# EasyEDA Pro project ROM外接板.eprj, board PCB1
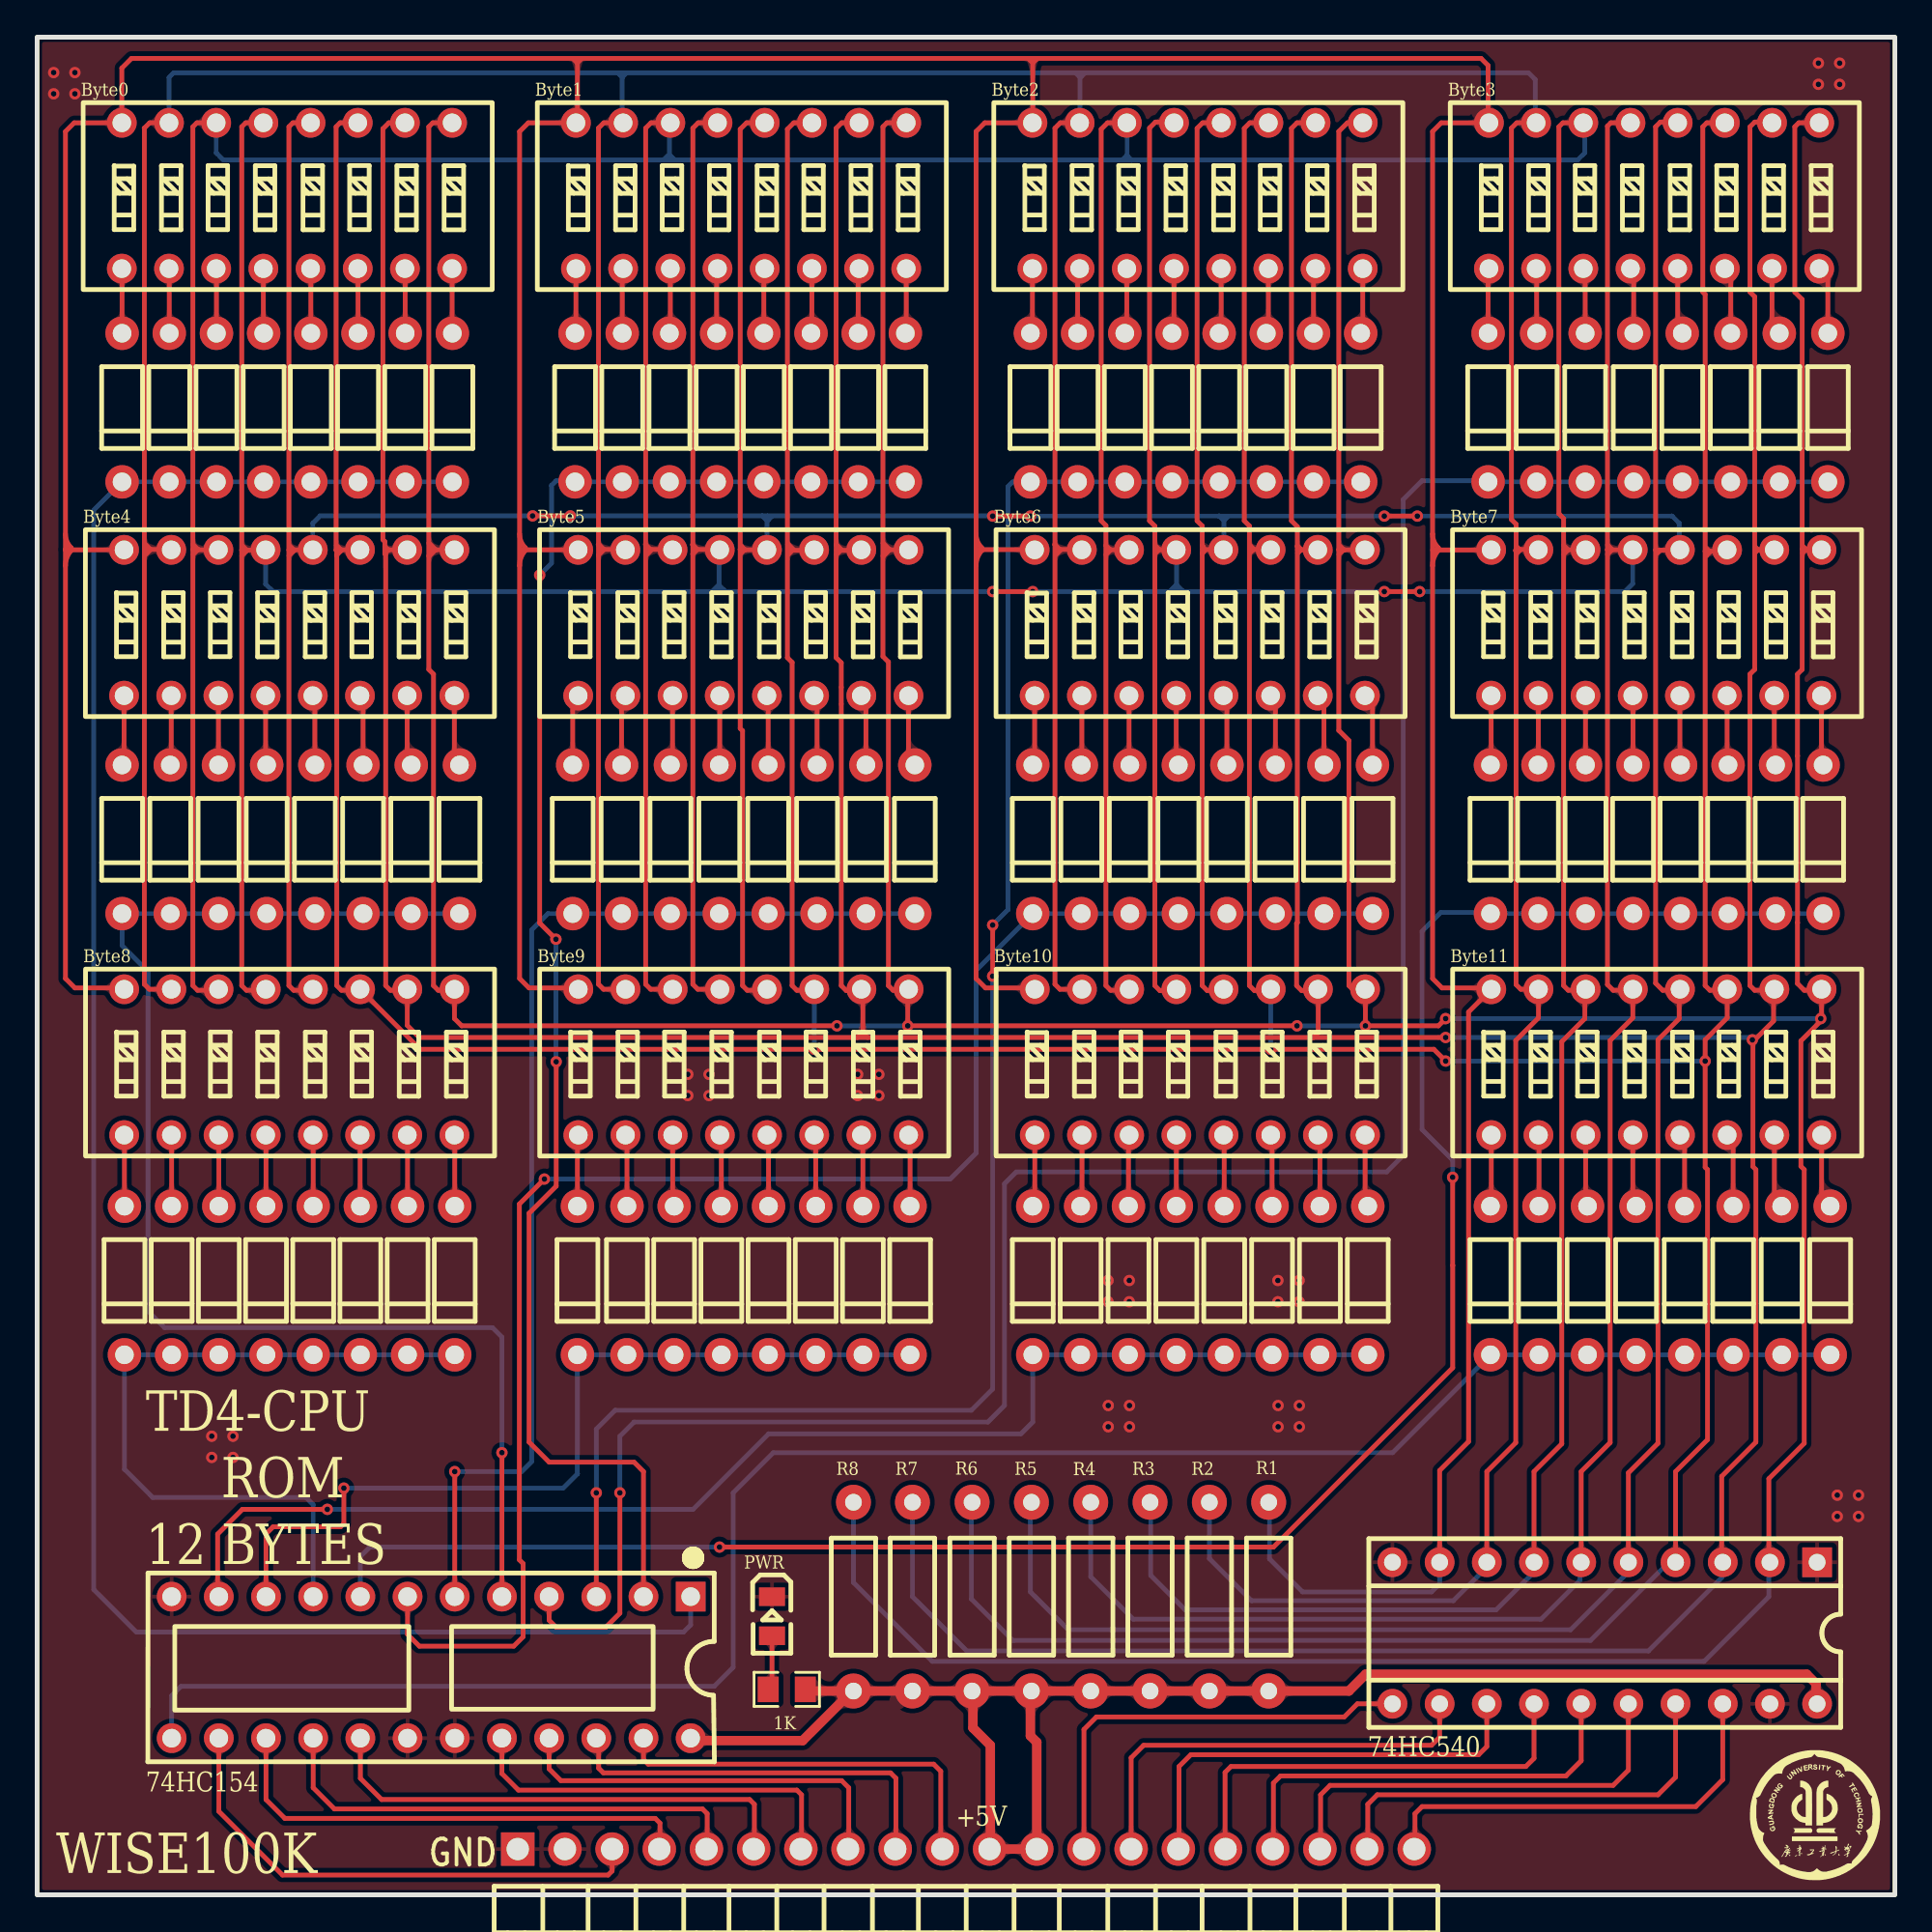
[diagram p1: board, top side]
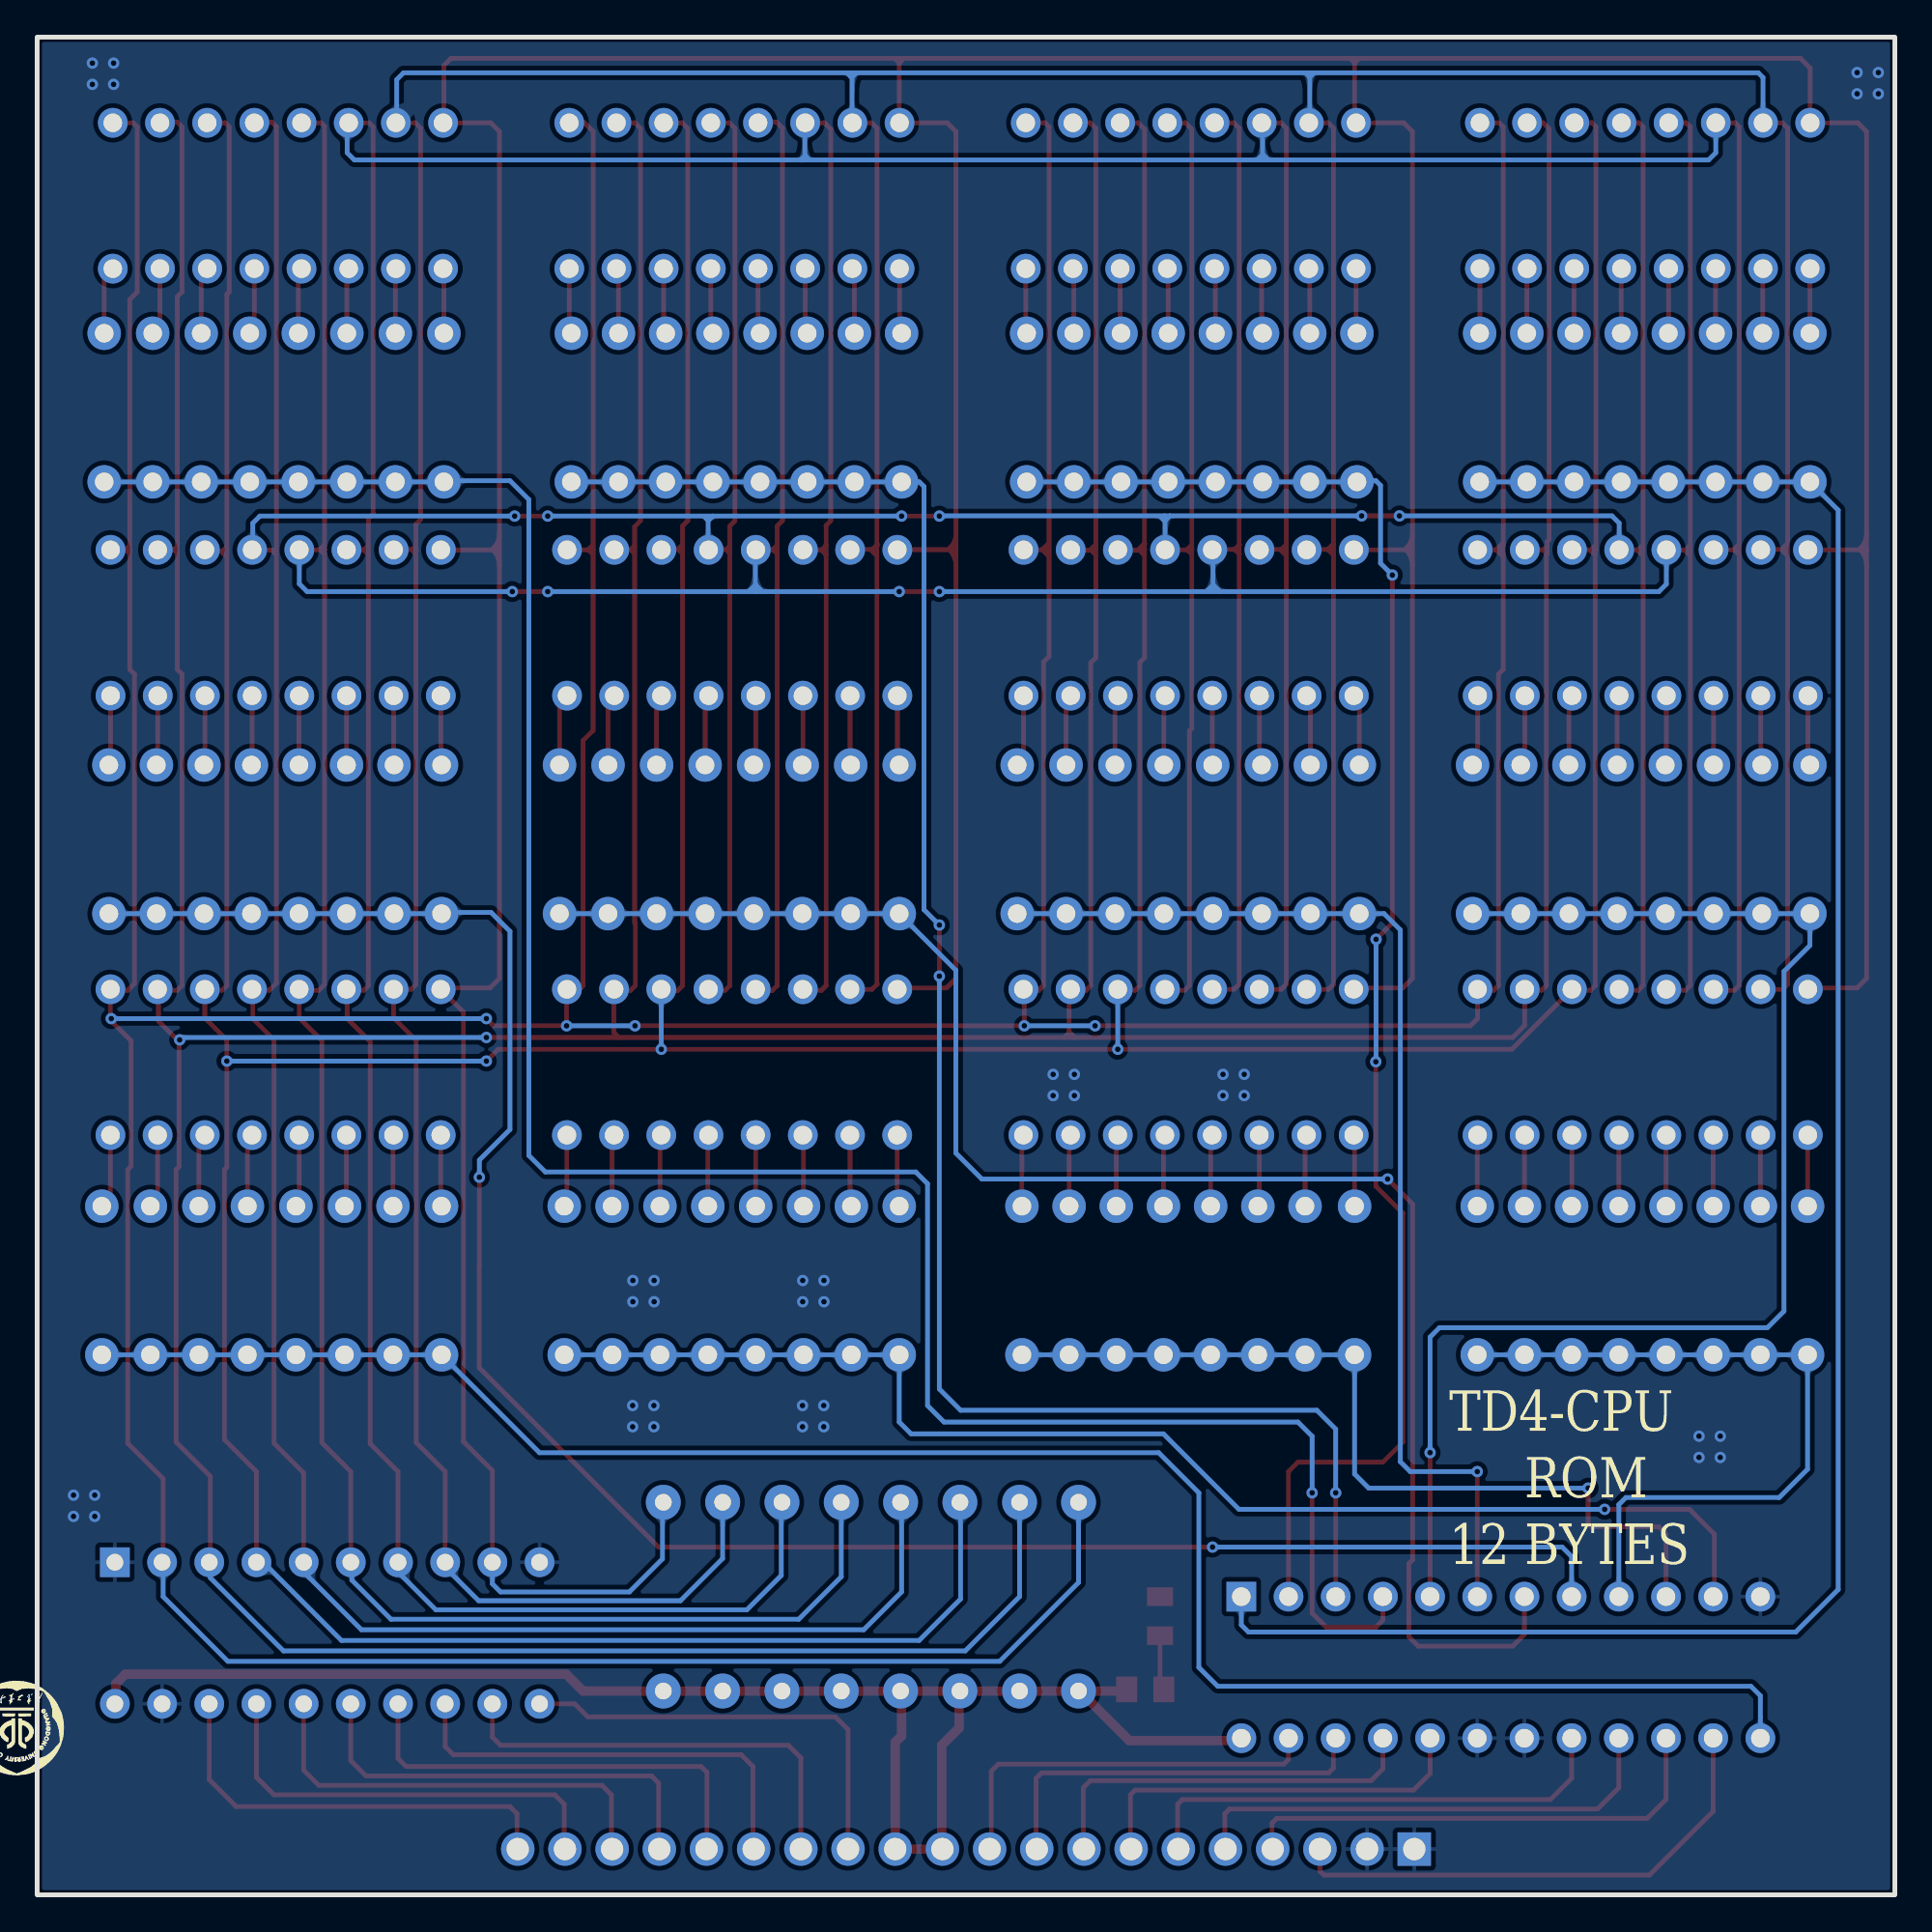
[diagram p2: board, bottom side, seen from below]

Outline 100 x 100 mm; copper layers: Top Layer, Bottom Layer. Coordinates in mm from the lower left corner of the outline.
Outline path: rectangle 0,100 100,0
Stack: Top Layer 0.035mm / Dielectric1 1.51mm FR4 er 4.5 / Bottom Layer 0.035mm

## Design rules (mm)
net +5V: VCC
template: 自定义配置
spacing copperThickness1oz (default): track to track 0.102, other pairs 0.152 to 0.3
spacing copperThickness2oz: track to track 0.203, other pairs 0.152 to 0.3
track width copperThickness1oz (default): min 0.127, default 0.254, max 2.54
track width copperThickness2oz: min 0.203, default 0.254, max 2.54
track width VCC: min 0.127, default 0.508, max 2.54
differential pair differentialPair (default): width min 0.127, default 0.254, max 2.54; gap min 0.152, default 0.152
via viaSize (default): diameter min 0.5, default 0.61, max 10; hole min 0.3, default 0.305, max 6.299
net class VCC uses VCC
net +5V uses VCC

## Placement (name value [footprint] x y rotation side)
1K  10K  [R0805]  40.35 11.06 180 top
Byte0  2.54插件8位拨码开关  [SW-TH_16P-L21.9-W9.9-P2.54-LS7.8]  13.45 91.46 0 top
Byte1  2.54插件8位拨码开关  [SW-TH_16P-L21.9-W9.9-P2.54-LS7.8]  37.89 91.46 0 top
Byte2  2.54插件8位拨码开关  [SW-TH_16P-L21.9-W9.9-P2.54-LS7.8]  62.47 91.46 0 top
Byte3  2.54插件8位拨码开关  [SW-TH_16P-L21.9-W9.9-P2.54-LS7.8]  87.04 91.46 0 top
Byte4  2.54插件8位拨码开关  [SW-TH_16P-L21.9-W9.9-P2.54-LS7.8]  13.57 68.48 0 top
Byte5  2.54插件8位拨码开关  [SW-TH_16P-L21.9-W9.9-P2.54-LS7.8]  38.01 68.48 0 top
Byte6  2.54插件8位拨码开关  [SW-TH_16P-L21.9-W9.9-P2.54-LS7.8]  62.59 68.48 0 top
Byte7  2.54插件8位拨码开关  [SW-TH_16P-L21.9-W9.9-P2.54-LS7.8]  87.16 68.48 0 top
Byte8  2.54插件8位拨码开关  [SW-TH_16P-L21.9-W9.9-P2.54-LS7.8]  13.57 44.82 0 top
Byte9  2.54插件8位拨码开关  [SW-TH_16P-L21.9-W9.9-P2.54-LS7.8]  38.02 44.82 0 top
Byte10  2.54插件8位拨码开关  [SW-TH_16P-L21.9-W9.9-P2.54-LS7.8]  62.59 44.82 0 top
Byte11  2.54插件8位拨码开关  [SW-TH_16P-L21.9-W9.9-P2.54-LS7.8]  87.17 44.82 0 top
D1  1N4148  [DO-35_BD2.0-L4.0-P8.00-D0.5-FD]  4.7 33.07 270 top
D2  1N4148  [DO-35_BD2.0-L4.0-P8.00-D0.5-FD]  7.24 33.07 270 top
D3  1N4148  [DO-35_BD2.0-L4.0-P8.00-D0.5-FD]  9.78 33.07 270 top
D4  1N4148  [DO-35_BD2.0-L4.0-P8.00-D0.5-FD]  12.32 33.07 270 top
D5  1N4148  [DO-35_BD2.0-L4.0-P8.00-D0.5-FD]  14.86 33.07 270 top
D6  1N4148  [DO-35_BD2.0-L4.0-P8.00-D0.5-FD]  17.4 33.07 270 top
D7  1N4148  [DO-35_BD2.0-L4.0-P8.00-D0.5-FD]  19.94 33.07 270 top
D8  1N4148  [DO-35_BD2.0-L4.0-P8.00-D0.5-FD]  22.48 33.07 270 top
D9  1N4148  [DO-35_BD2.0-L4.0-P8.00-D0.5-FD]  29.08 33.07 270 top
D10  1N4148  [DO-35_BD2.0-L4.0-P8.00-D0.5-FD]  31.75 33.07 270 top
D11  1N4148  [DO-35_BD2.0-L4.0-P8.00-D0.5-FD]  34.29 33.07 270 top
D12  1N4148  [DO-35_BD2.0-L4.0-P8.00-D0.5-FD]  36.83 33.07 270 top
D13  1N4148  [DO-35_BD2.0-L4.0-P8.00-D0.5-FD]  39.37 33.07 270 top
D14  1N4148  [DO-35_BD2.0-L4.0-P8.00-D0.5-FD]  41.91 33.07 270 top
D15  1N4148  [DO-35_BD2.0-L4.0-P8.00-D0.5-FD]  44.45 33.07 270 top
D16  1N4148  [DO-35_BD2.0-L4.0-P8.00-D0.5-FD]  46.99 33.07 270 top
D17  1N4148  [DO-35_BD2.0-L4.0-P8.00-D0.5-FD]  53.59 33.07 270 top
D18  1N4148  [DO-35_BD2.0-L4.0-P8.00-D0.5-FD]  56.17 33.07 270 top
D19  1N4148  [DO-35_BD2.0-L4.0-P8.00-D0.5-FD]  58.75 33.07 270 top
D20  1N4148  [DO-35_BD2.0-L4.0-P8.00-D0.5-FD]  61.32 33.07 270 top
D21  1N4148  [DO-35_BD2.0-L4.0-P8.00-D0.5-FD]  63.9 33.07 270 top
D22  1N4148  [DO-35_BD2.0-L4.0-P8.00-D0.5-FD]  66.48 33.07 270 top
D23  1N4148  [DO-35_BD2.0-L4.0-P8.00-D0.5-FD]  69.05 33.07 270 top
D24  1N4148  [DO-35_BD2.0-L4.0-P8.00-D0.5-FD]  71.63 33.07 270 top
D25  1N4148  [DO-35_BD2.0-L4.0-P8.00-D0.5-FD]  78.23 33.07 270 top
D26  1N4148  [DO-35_BD2.0-L4.0-P8.00-D0.5-FD]  80.84 33.07 270 top
D27  1N4148  [DO-35_BD2.0-L4.0-P8.00-D0.5-FD]  83.46 33.07 270 top
D28  1N4148  [DO-35_BD2.0-L4.0-P8.00-D0.5-FD]  86.07 33.07 270 top
D29  1N4148  [DO-35_BD2.0-L4.0-P8.00-D0.5-FD]  88.68 33.07 270 top
D30  1N4148  [DO-35_BD2.0-L4.0-P8.00-D0.5-FD]  91.29 33.07 270 top
D31  1N4148  [DO-35_BD2.0-L4.0-P8.00-D0.5-FD]  93.91 33.07 270 top
D32  1N4148  [DO-35_BD2.0-L4.0-P8.00-D0.5-FD]  96.52 33.07 270 top
D65  1N4148  [DO-35_BD2.0-L4.0-P8.00-D0.5-FD]  4.57 80.06 270 top
D66  1N4148  [DO-35_BD2.0-L4.0-P8.00-D0.5-FD]  7.11 80.06 270 top
D67  1N4148  [DO-35_BD2.0-L4.0-P8.00-D0.5-FD]  9.65 80.06 270 top
D68  1N4148  [DO-35_BD2.0-L4.0-P8.00-D0.5-FD]  12.19 80.06 270 top
D69  1N4148  [DO-35_BD2.0-L4.0-P8.00-D0.5-FD]  14.73 80.06 270 top
D70  1N4148  [DO-35_BD2.0-L4.0-P8.00-D0.5-FD]  17.27 80.06 270 top
D71  1N4148  [DO-35_BD2.0-L4.0-P8.00-D0.5-FD]  19.81 80.06 270 top
D72  1N4148  [DO-35_BD2.0-L4.0-P8.00-D0.5-FD]  22.35 80.06 270 top
D73  1N4148  [DO-35_BD2.0-L4.0-P8.00-D0.5-FD]  28.96 80.06 270 top
D74  1N4148  [DO-35_BD2.0-L4.0-P8.00-D0.5-FD]  31.5 80.06 270 top
D75  1N4148  [DO-35_BD2.0-L4.0-P8.00-D0.5-FD]  34.04 80.06 270 top
D76  1N4148  [DO-35_BD2.0-L4.0-P8.00-D0.5-FD]  36.58 80.06 270 top
D77  1N4148  [DO-35_BD2.0-L4.0-P8.00-D0.5-FD]  39.12 80.06 270 top
D78  1N4148  [DO-35_BD2.0-L4.0-P8.00-D0.5-FD]  41.66 80.06 270 top
D79  1N4148  [DO-35_BD2.0-L4.0-P8.00-D0.5-FD]  44.2 80.06 270 top
D80  1N4148  [DO-35_BD2.0-L4.0-P8.00-D0.5-FD]  46.74 80.06 270 top
D81  1N4148  [DO-35_BD2.0-L4.0-P8.00-D0.5-FD]  53.47 80.06 270 top
D82  1N4148  [DO-35_BD2.0-L4.0-P8.00-D0.5-FD]  56.01 80.06 270 top
D83  1N4148  [DO-35_BD2.0-L4.0-P8.00-D0.5-FD]  58.55 80.06 270 top
D84  1N4148  [DO-35_BD2.0-L4.0-P8.00-D0.5-FD]  61.09 80.06 270 top
D85  1N4148  [DO-35_BD2.0-L4.0-P8.00-D0.5-FD]  63.63 80.06 270 top
D86  1N4148  [DO-35_BD2.0-L4.0-P8.00-D0.5-FD]  66.17 80.06 270 top
D87  1N4148  [DO-35_BD2.0-L4.0-P8.00-D0.5-FD]  68.71 80.06 270 top
D88  1N4148  [DO-35_BD2.0-L4.0-P8.00-D0.5-FD]  71.25 80.06 270 top
D89  1N4148  [DO-35_BD2.0-L4.0-P8.00-D0.5-FD]  78.1 80.06 270 top
D90  1N4148  [DO-35_BD2.0-L4.0-P8.00-D0.5-FD]  80.72 80.06 270 top
D91  1N4148  [DO-35_BD2.0-L4.0-P8.00-D0.5-FD]  83.33 80.06 270 top
D92  1N4148  [DO-35_BD2.0-L4.0-P8.00-D0.5-FD]  85.94 80.06 270 top
D93  1N4148  [DO-35_BD2.0-L4.0-P8.00-D0.5-FD]  88.56 80.06 270 top
D94  1N4148  [DO-35_BD2.0-L4.0-P8.00-D0.5-FD]  91.17 80.06 270 top
D95  1N4148  [DO-35_BD2.0-L4.0-P8.00-D0.5-FD]  93.78 80.06 270 top
D96  1N4148  [DO-35_BD2.0-L4.0-P8.00-D0.5-FD]  96.39 80.06 270 top
D97  1N4148  [DO-35_BD2.0-L4.0-P8.00-D0.5-FD]  4.57 56.82 270 top
D98  1N4148  [DO-35_BD2.0-L4.0-P8.00-D0.5-FD]  7.17 56.82 270 top
D99  1N4148  [DO-35_BD2.0-L4.0-P8.00-D0.5-FD]  9.76 56.82 270 top
D100  1N4148  [DO-35_BD2.0-L4.0-P8.00-D0.5-FD]  12.36 56.82 270 top
D101  1N4148  [DO-35_BD2.0-L4.0-P8.00-D0.5-FD]  14.95 56.82 270 top
D102  1N4148  [DO-35_BD2.0-L4.0-P8.00-D0.5-FD]  17.54 56.82 270 top
D103  1N4148  [DO-35_BD2.0-L4.0-P8.00-D0.5-FD]  20.14 56.82 270 top
D104  1N4148  [DO-35_BD2.0-L4.0-P8.00-D0.5-FD]  22.73 56.82 270 top
D105  1N4148  [DO-35_BD2.0-L4.0-P8.00-D0.5-FD]  28.83 56.82 270 top
D106  1N4148  [DO-35_BD2.0-L4.0-P8.00-D0.5-FD]  31.46 56.82 270 top
D107  1N4148  [DO-35_BD2.0-L4.0-P8.00-D0.5-FD]  34.09 56.82 270 top
D108  1N4148  [DO-35_BD2.0-L4.0-P8.00-D0.5-FD]  36.72 56.82 270 top
D109  1N4148  [DO-35_BD2.0-L4.0-P8.00-D0.5-FD]  39.35 56.82 270 top
D110  1N4148  [DO-35_BD2.0-L4.0-P8.00-D0.5-FD]  41.98 56.82 270 top
D111  1N4148  [DO-35_BD2.0-L4.0-P8.00-D0.5-FD]  44.61 56.82 270 top
D112  1N4148  [DO-35_BD2.0-L4.0-P8.00-D0.5-FD]  47.24 56.82 270 top
D113  1N4148  [DO-35_BD2.0-L4.0-P8.00-D0.5-FD]  53.59 56.82 270 top
D114  1N4148  [DO-35_BD2.0-L4.0-P8.00-D0.5-FD]  56.21 56.82 270 top
D115  1N4148  [DO-35_BD2.0-L4.0-P8.00-D0.5-FD]  58.82 56.82 270 top
D116  1N4148  [DO-35_BD2.0-L4.0-P8.00-D0.5-FD]  61.43 56.82 270 top
D117  1N4148  [DO-35_BD2.0-L4.0-P8.00-D0.5-FD]  64.04 56.82 270 top
D118  1N4148  [DO-35_BD2.0-L4.0-P8.00-D0.5-FD]  66.66 56.82 270 top
D119  1N4148  [DO-35_BD2.0-L4.0-P8.00-D0.5-FD]  69.27 56.82 270 top
D120  1N4148  [DO-35_BD2.0-L4.0-P8.00-D0.5-FD]  71.88 56.82 270 top
D121  1N4148  [DO-35_BD2.0-L4.0-P8.00-D0.5-FD]  78.23 56.82 270 top
D122  1N4148  [DO-35_BD2.0-L4.0-P8.00-D0.5-FD]  80.79 56.82 270 top
D123  1N4148  [DO-35_BD2.0-L4.0-P8.00-D0.5-FD]  83.35 56.82 270 top
D124  1N4148  [DO-35_BD2.0-L4.0-P8.00-D0.5-FD]  85.91 56.82 270 top
D125  1N4148  [DO-35_BD2.0-L4.0-P8.00-D0.5-FD]  88.46 56.82 270 top
D126  1N4148  [DO-35_BD2.0-L4.0-P8.00-D0.5-FD]  91.02 56.82 270 top
D127  1N4148  [DO-35_BD2.0-L4.0-P8.00-D0.5-FD]  93.58 56.82 270 top
D128  1N4148  [DO-35_BD2.0-L4.0-P8.00-D0.5-FD]  96.14 56.82 270 top
H3  KH-A2541WR-20P  [HDR-TH_20P-P2.54-H-M-W10.5]  50 2.46 0 top
PWR  KT-0805Y  [LED0805-R-RD]  39.56 15 270 top
R1  10K  [R_AXIAL-0.4]  66.29 16.05 270 top
R2  10K  [R_AXIAL-0.4]  63.1 16.05 270 top
R3  10K  [R_AXIAL-0.4]  59.91 16.05 270 top
R4  10K  [R_AXIAL-0.4]  56.71 16.05 270 top
R5  10K  [R_AXIAL-0.4]  53.52 16.05 270 top
R6  10K  [R_AXIAL-0.4]  50.33 16.05 270 top
R7  10K  [R_AXIAL-0.4]  47.12 16.05 270 top
R8  10K  [R_AXIAL-0.4]  43.94 16.05 270 top
U2  SN74HC540N  [DIP-20_L25.4-W10.2-P2.54-LS10.2-BL_SOCKET]  84.39 14.09 180 top
U18  -  [DIP-24_L30.5-W10.2-P2.54-LS7.6-BL_IC-24P]  21.21 12.24 180 top

## Footprints (pads in the part's own frame, mm; a bottom-side part is the same pattern mirrored in y, then rotated)
DIP-20_L25.4-W10.2-P2.54-LS10.2-BL_SOCKET
  rect 1.6x1.6 hole 0.9: 1(-11.43,-3.81)
  round 1.6 hole 0.9: 2(-8.89,-3.81) 3(-6.35,-3.81) 4(-3.81,-3.81) 5(-1.27,-3.81) 6(1.27,-3.81) 7(3.81,-3.81) 8(6.35,-3.81) 9(8.89,-3.81) 10(11.43,-3.81) 11(11.43,3.81) 12(8.89,3.81) 13(6.35,3.81) 14(3.81,3.81) 15(1.27,3.81) 16(-1.27,3.81) 17(-3.81,3.81) 18(-6.35,3.81) 19(-8.89,3.81) 20(-11.43,3.81)
DIP-24_L30.5-W10.2-P2.54-LS7.6-BL_IC-24P
  rect 1.6x1.6 hole 1: 1(-13.97,-3.81)
  round 1.6 hole 1: 2(-11.43,-3.81) 3(-8.89,-3.81) 4(-6.35,-3.81) 5(-3.81,-3.81) 6(-1.27,-3.81) 7(1.27,-3.81) 8(3.81,-3.81) 9(6.35,-3.81) 10(8.89,-3.81) 11(11.43,-3.81) 12(13.97,-3.81) 13(13.97,3.81) 14(11.43,3.81) 15(8.89,3.81) 16(6.35,3.81) 17(3.81,3.81) 18(1.27,3.81) 19(-1.27,3.81) 20(-3.81,3.81) 21(-6.35,3.81) 22(-8.89,3.81) 23(-11.43,3.81) 24(-13.97,3.81)
DO-35_BD2.0-L4.0-P8.00-D0.5-FD
  round 1.8 hole 1: 1(-4,0) 2(4,0)
HDR-TH_20P-P2.54-H-M-W10.5
  rect 1.8x1.8 hole 1.2: 1(-24.13,0)
  round 1.8 hole 1.2: 2(-21.59,0) 3(-19.05,0) 4(-16.51,0) 5(-13.97,0) 6(-11.43,0) 7(-8.89,0) 8(-6.35,0) 9(-3.81,0) 10(-1.27,0) 11(1.27,0) 12(3.81,0) 13(6.35,0) 14(8.89,0) 15(11.43,0) 16(13.97,0) 17(16.51,0) 18(19.05,0) 19(21.59,0) 20(24.13,0)
LED0805-R-RD
  rect 1x1.399 smd: 1(1.05,0) 2(-1.05,0)
R0805
  rect 1.133x1.377 smd: 1(-1,0) 2(1,0)
R_AXIAL-0.4
  round 1.879 hole 0.899: 1(-5.08,0) 2(5.08,0)
SW-TH_16P-L21.9-W9.9-P2.54-LS7.8
  round 1.6 hole 1: 1(-8.89,-3.925) 2(-6.35,-3.925) 3(-3.81,-3.925) 4(-1.27,-3.925) 5(1.27,-3.925) 6(3.81,-3.925) 7(6.35,-3.925) 8(8.89,-3.925) 9(8.89,3.925) 10(6.35,3.925) 11(3.81,3.925) 12(1.27,3.925) 13(-1.27,3.925) 14(-3.81,3.925) 15(-6.35,3.925) 16(-8.89,3.925)

## Nets
As in the schematic, except:
+5V: 1K.1 H3.11 H3.12 R1.2 R2.2 R3.2 R4.2 R5.2 R6.2 R7.2 R8.2 U2.20 U18.24
GND: H3.1 H3.2 PWR.2 U2.1 U2.10 U2.19 U18.12 U18.18 U18.19
A0: H3.10 U18.23
A1: H3.9 U18.22
A2: H3.8 U18.21
A3: H3.7 U18.20
Y0: D65.2 D66.2 D67.2 D68.2 D69.2 D70.2 D71.2 D72.2 U18.1
Y1: D73.2 D74.2 D75.2 D76.2 D77.2 D78.2 D79.2 D80.2 U18.2
Y2: D81.2 D82.2 D83.2 D84.2 D85.2 D86.2 D87.2 D88.2 U18.3
Y3: D89.2 D90.2 D91.2 D92.2 D93.2 D94.2 D95.2 D96.2 U18.4
Y4: D97.2 D98.2 D99.2 D100.2 D101.2 D102.2 D103.2 D104.2 U18.5
Y5: D105.2 D106.2 D107.2 D108.2 D109.2 D110.2 D111.2 D112.2 U18.6
Y6: D113.2 D114.2 D115.2 D116.2 D117.2 D118.2 D119.2 D120.2 U18.7
Y7: D121.2 D122.2 D123.2 D124.2 D125.2 D126.2 D127.2 D128.2 U18.8
Y8: D1.2 D2.2 D3.2 D4.2 D5.2 D6.2 D7.2 D8.2 U18.9
Y9: D9.2 D10.2 D11.2 D12.2 D13.2 D14.2 D15.2 D16.2 U18.10
Y10: D17.2 D18.2 D19.2 D20.2 D21.2 D22.2 D23.2 D24.2 U18.11
Y12: H3.3 U18.14
Y13: H3.4 U18.15
Y14: H3.5 U18.16
Y15: H3.6 U18.17
$1N30826: 1K.2 PWR.1

## Via types
v1: diameter 0.61, hole 0.305, Top Layer to Bottom Layer, 76 vias

## Routing (per net, layer and track width the routed paths; a pad name or vN(x,y) marks a point on that pad's centre or on a via; arc(x,y) is an arc through that point)
+5V: length 86
  Top Layer w0.508: 43.88,10.97 41.21,8.3 35.18,8.3 ; 43.88,10.97 41.42,10.97 41.33,11.06 ; 43.88,10.97 R8.2 R6.2 50.46,10.97 ; R5.2 R4.2 R3.2 R2.2 R1.2 ; R5.2 50.46,10.97 ; R5.2 53.47,10.92 53.47,8.56 53.81,8.22 H3.12 H3.11 51.31,2.5 51.31,8.05 50.37,8.99 50.37,10.89 50.46,10.97 ; 66.42,10.85 66.55,10.97 70.61,10.97 71.52,11.88 95.25,11.88 95.76,11.37 95.76,10.34 U2.20
GND:
  vias: v1(0.89,98.1) v1(0.89,96.95) v1(2.03,98.1) v1(2.03,96.95) v1(9.4,24.69) v1(9.4,23.55) v1(10.54,24.69) v1(10.54,23.55) v1(35.02,44.17) v1(35.02,43.02) v1(36.17,44.17) v1(36.17,43.02) v1(44.17,44.17) v1(44.17,43.02) v1(45.31,44.17) v1(45.31,43.02) v1(57.65,33.07) v1(57.65,31.93) v1(57.66,26.34) v1(57.66,25.2) v1(58.79,33.07) v1(58.79,31.93) v1(58.8,26.34) v1(58.8,25.2) v1(66.79,33.07) v1(66.79,31.93) v1(66.8,26.34) v1(66.8,25.2) v1(67.93,33.07) v1(67.93,31.93) v1(67.94,26.34) v1(67.94,25.2) v1(95.88,98.6) v1(95.88,97.46) v1(96.9,21.51) v1(96.9,20.37) v1(97.03,98.6) v1(97.03,97.46) v1(98.04,21.51) v1(98.04,20.37)
A0: length 21.5
  Top Layer w0.254: H3.10 48.64,2.55 48.64,6.66 48.26,7.04 32.89,7.04 32.64,7.29 32.64,8.3
A1: length 21.6
  Top Layer w0.254: 30.1,8.3 30.23,8.18 30.23,6.82 30.48,6.57 45.94,6.57 46.23,6.27 46.23,2.5 H3.9
A2: length 21.4
  Top Layer w0.254: 27.56,8.3 27.56,6.78 28.19,6.15 43.31,6.15 43.69,5.77 43.69,2.5 H3.8
A3: length 21.3
  Top Layer w0.254: 25.02,8.3 25.02,6.53 25.91,5.64 40.89,5.64 41.15,5.39 41.15,2.5 H3.7
D0: length 23.3
  Top Layer w0.254: H3.20 74.17,2.5 74.17,4.37 74.55,4.75 89.28,4.75 90.74,6.21 U2.18
D1: length 23.6
  Top Layer w0.254: H3.19 71.63,2.5 71.63,4.88 72.14,5.39 87.25,5.39 88.2,6.33 U2.17
D2: length 23.6
  Top Layer w0.254: H3.18 69.09,2.5 69.09,5.39 69.6,5.89 84.84,5.89 85.66,6.71 U2.16
D3: length 23.7
  Top Layer w0.254: H3.17 66.55,2.5 66.55,6.02 66.93,6.4 82.3,6.4 83.12,7.22 U2.15
D4: length 24
  Top Layer w0.254: H3.16 63.94,2.49 63.94,6.59 64.26,6.91 80.14,6.91 80.58,7.35 U2.14
D5: length 23.8
  Top Layer w0.254: H3.15 61.47,2.5 61.47,6.91 62.1,7.54 77.6,7.54 78.04,7.98 U2.13
D6: length 23.8
  Top Layer w0.254: U2.12 75.5,8.49 75.06,8.05 59.56,8.05 58.89,7.38 H3.14
D7: length 23.6
  Top Layer w0.254: U2.11 71.07,10.28 70.36,9.58 57.02,9.58 56.35,8.9 H3.13
Y0: length 112.8
  Bottom Layer w0.254: U18.1 35.18,14.53 34.8,14.15 5.33,14.15 3.05,16.43 3.05,74.54 D65.2 D66.2 D67.2 D68.2 D69.2 D70.2 D71.2 D72.2
Y1: length 85.5
  Top Layer w0.254: v1(27.05,71.04) 27.05,52.32 v1(27.93,51.44) ; U18.2 32.64,22.78 32.13,23.29 27.56,23.29 26.48,24.37 26.48,36.69 27.94,38.15 v1(27.94,44.85)
  Bottom Layer w0.254: v1(27.93,51.44) 27.93,44.86 v1(27.94,44.85) ; D80.2 D79.2 D78.2 D77.2 D76.2 D75.2 D74.2 D73.2 28.89,76.12 27.94,76.12 27.69,75.87 27.69,71.68 v1(27.05,71.04)
Y2: length 99.3
  Top Layer w0.254: v1(51.44,49.45) v1(51.44,52.2) ; v1(30.1,21.64) U18.3
  Bottom Layer w0.254: v1(51.44,52.2) 52.26,53.03 52.26,75.81 52.51,76.06 D81.2 D82.2 D83.2 D84.2 D85.2 D86.2 D87.2 D88.2 ; v1(51.44,49.45) 51.44,27.23 50.29,26.09 31.12,26.09 30.1,25.07 v1(30.1,21.64)
Y3: length 129.1
  Top Layer w0.254: v1(31.37,21.64) 31.37,15.16 30.61,14.4 27.94,14.4 27.56,14.78 U18.4
  Bottom Layer w0.254: D96.2 D95.2 D94.2 D93.2 D92.2 D91.2 D90.2 D89.2 78.04,76.12 74.55,76.12 73.53,75.11 73.53,39.8 72.64,38.91 52.71,38.91 52.07,38.28 52.07,26.34 51.18,25.45 32.13,25.45 31.37,24.69 v1(31.37,21.64)
Y4: length 73.7
  Top Layer w0.254: v1(25.02,23.8) U18.5
  Bottom Layer w0.254: v1(25.02,23.8) 25.02,30.02 24.51,30.53 6.86,30.53 5.97,31.42 5.97,49.71 4.57,51.11 D97.2 D98.2 D99.2 D100.2 D101.2 D102.2 D103.2 D104.2
Y5: length 60.7
  Top Layer w0.254: v1(22.48,22.78) U18.6
  Bottom Layer w0.254: D112.2 D111.2 D110.2 D109.2 D108.2 D107.2 D106.2 D105.2 27.5,52.82 26.62,51.94 26.62,23.32 26.09,22.78 v1(22.48,22.78)
Y6: length 90.3
  Top Layer w0.254: v1(27.31,38.53) 25.96,37.19 25.96,18.03 26.16,17.83 26.16,13.89 25.65,13.39 20.57,13.39 19.94,14.02 U18.7 19.89,16.1
  Bottom Layer w0.254: v1(27.31,38.53) 49.15,38.53 50.55,39.93 50.55,49.77 D113.2 D114.2 D115.2 D116.2 D117.2 D118.2 D119.2 D120.2
Y7: length 111.4
  Top Layer w0.254: v1(36.73,18.72) 66.55,18.72 76.2,28.37 76.2,33.88 76.2,33.88 v1(76.2,38.63)
  Bottom Layer w0.254: v1(36.73,18.72) 17.91,18.72 17.4,18.21 U18.8 ; v1(76.2,38.63) 76.2,39.55 74.55,41.2 74.55,51.87 75.56,52.88 78.17,52.88 D121.2 D122.2 D123.2 D124.2 D125.2 D126.2 D127.2 D128.2
Y8: length 39.8
  Bottom Layer w0.254: U18.9 14.86,21.01 14.48,21.39 6.22,21.39 4.7,22.91 D1.2 D2.2 D3.2 D4.2 D5.2 D6.2 D7.2 D8.2
Y9: length 46.9
  Top Layer w0.254: v1(16.51,21.9) 16.51,19.99 16.33,19.81 12.7,19.81 12.32,19.43 U18.10
  Bottom Layer w0.254: D16.2 D15.2 D14.2 D13.2 D12.2 D11.2 D10.2 D9.2 29.08,22.66 28.32,21.9 v1(16.51,21.9)
Y10: length 71.4
  Top Layer w0.254: v1(15.62,20.75) 11.05,20.75 9.72,19.42 9.72,16.12 U18.11
  Bottom Layer w0.254: D24.2 D23.2 D22.2 D21.2 D20.2 D19.2 D18.2 D17.2 53.59,25.45 52.96,24.82 39.37,24.82 35.31,20.75 v1(15.62,20.75)
Y11: length 104.8
  Bottom Layer w0.254: 7.24,8.3 7.24,10.72 7.75,11.23 36.45,11.23 37.47,12.24 37.47,21.64 39.62,23.8 72.96,23.8 D25.2 D26.2 D27.2 D28.2 D29.2 D30.2 D31.2 D32.2
Y12: length 27.7
  Top Layer w0.254: 9.78,8.3 9.78,4.5 13.21,1.07 30.73,1.07 30.95,1.28 H3.3
Y13: length 26.3
  Top Layer w0.254: 12.32,8.3 12.32,5.13 13.33,4.12 33.27,4.12 33.53,3.86 33.53,2.5 H3.4
Y14: length 26.2
  Top Layer w0.254: H3.5 36.07,2.5 36.07,4.37 35.81,4.62 16,4.62 14.86,5.77 14.86,8.3
Y15: length 26.2
  Top Layer w0.254: H3.6 38.61,2.5 38.61,4.88 38.35,5.13 18.54,5.13 17.4,6.27 17.4,8.3
$1N2008: length 375.1
  Top Layer w0.254: Byte2.9 70.53,95.39 70.07,94.93 70.07,72.41 ; 46.86,48.7 Byte9.9 ; 46.86,48.7 v1(46.86,46.78) v1(67.82,46.78) ; 46.86,48.7 46.85,48.69 46.08,48.69 45.82,48.95 45.82,66.37 45.53,66.66 45.53,95.17 45.74,95.39 Byte1.9 ; 21.16,72.41 21.16,72.41 21.4,72.41 ; 70.35,72.4 70.32,72.4 70.08,72.16 ; 70.35,72.4 70.34,72.4 ; 70.35,72.4 70.38,72.4 ; 70.35,72.4 70.35,72.4 ; 45.85,72.41 45.61,72.41 45.6,72.41 ; 21.45,72.39 21.43,72.39 ; 21.43,72.39 21.43,72.43 21.09,72.77 21.09,72.77 ; 21.43,72.39 21.12,72.08 21.08,72.08 ; 21.46,72.4 21.45,72.39 21.45,72.4 21.46,72.4 ; 21.46,72.4 21.47,72.41 ; 21.46,72.4 22.46,72.4 ; 95.22,72.44 95.05,72.6 ; 95.22,72.44 95.23,72.42 ; 95.22,72.44 96.02,72.44 96.05,72.4 95.25,72.4 95.23,72.42 ; 95.22,72.44 95.01,72.44 ; 45.53,72.08 45.56,72.08 45.88,72.39 45.88,72.43 45.54,72.77 45.54,72.77 ; 70.34,72.4 70.1,72.65 ; 70.34,72.4 70.07,72.4 70.07,72.41 ; 70.34,72.4 70.38,72.4 ; 71.48,72.4 70.38,72.4 ; 95.23,72.42 95.02,72.22 ; 95.23,72.42 95.23,72.43 ; Byte0.9 21.3,95.39 21.08,95.17 21.08,65.96 21.34,65.71 21.34,48.95 21.59,48.69 22.41,48.69 Byte8.9 22.46,47.17 22.85,46.78 v1(43.05,46.78) ; 95.01,72.44 95.01,85.88 94.62,86.28 94.62,95.17 94.83,95.39 Byte3.9 ; 95.01,72.44 95.01,65.96 94.76,65.71 94.76,61.31 94.76,61.31 94.76,52.33 94.76,52.33 94.76,49.06 95.12,48.69 96,48.69 Byte11.9 96.06,47.09 94.94,45.97 94.94,39.22 95.12,39.04 95.12,24.31 93.22,22.4 93.22,17.96 93.28,17.9 ; 46.9,72.4 45.91,72.4 ; 70.07,72.41 70.07,62.68 70.61,62.14 70.61,48.95 70.81,48.75 Byte10.9 71.5,48.73 v1(71.5,46.78) 75.43,46.78 v1(75.82,47.17)
  Bottom Layer w0.254: v1(43.05,46.78) v1(46.86,46.78) ; 93.28,17.9 93.22,17.85 93.22,16.05 89.74,12.57 48.19,12.57 43.94,16.81 R8.1 ; v1(67.82,46.78) v1(71.5,46.78) ; v1(75.82,47.17) v1(96.01,47.17)
$1N2018: length 367.7
  Top Layer w0.254: 93.47,48.7 93.47,47.04 92.36,45.93 92.36,39.2 92.52,39.04 92.52,24.37 90.68,22.53 90.68,17.96 90.74,17.9 ; 93.47,48.7 Byte11.10 ; 93.47,48.7 93.46,48.69 92.46,48.69 92.2,48.95 92.2,65.71 92.46,65.96 92.46,72.35 ; Byte2.10 67.82,95.39 67.52,95.09 67.52,73.97 67.84,73.65 67.84,72.59 ; 92.46,72.35 92.46,86.03 92.2,86.28 92.2,95.17 92.46,95.43 93.35,95.43 Byte3.10 ; 92.46,72.35 92.51,72.4 92.63,72.4 ; 18.72,72.2 18.72,72.58 ; 18.72,72.2 18.76,72.15 18.76,48.95 19.02,48.69 19.87,48.69 Byte8.10 19.92,46.8 20.57,46.15 44.15,46.15 ; 18.72,72.2 18.91,72.39 ; 18.72,72.58 18.91,72.39 ; 18.72,72.58 18.72,72.84 18.61,72.95 18.61,95.07 18.93,95.39 Byte0.10 ; 68.94,72.4 68.04,72.4 ; 68.04,72.4 67.85,72.4 67.85,72.41 ; 68.04,72.4 68.05,72.41 ; 68.04,72.4 67.86,72.23 67.84,72.23 ; 92.63,72.4 92.64,72.41 ; 92.63,72.4 93.51,72.4 ; 92.63,72.4 92.47,72.24 ; 43.01,72.67 43.01,66.6 43.28,66.32 43.28,65 43.28,48.95 43.55,48.68 44.3,48.68 Byte9.10 44.45,48.67 44.45,46.45 44.15,46.15 ; 43.01,72.67 43.01,95.09 43.31,95.39 Byte1.10 ; 43.01,72.67 43.04,72.67 43.32,72.39 ; 44.15,46.15 68.7,46.15 ; 68.7,46.15 68.96,46.41 68.96,48.73 Byte10.10 68.38,48.75 68.31,48.68 68.06,48.68 67.8,48.95 67.8,52.29 67.84,52.33 67.84,72.59 ; 68.7,46.15 v1(75.82,46.15) ; 68.05,72.41 68.05,72.41 ; 68.05,72.41 68.05,72.42 ; 68.05,72.41 67.86,72.59 67.84,72.59 ; 44.36,72.38 43.26,72.38 ; 43.26,72.38 43.02,72.14 ; 43.26,72.38 43.02,72.38 ; 43.26,72.38 43.28,72.4 ; 44.43,46.41 44.45,46.41 44.71,46.15 ; 18.91,72.39 18.92,72.4 19.92,72.4 ; 18.91,72.39 18.93,72.41 ; 67.84,72.59 67.83,72.59 ; 92.64,72.41 92.47,72.57
  Bottom Layer w0.254: R7.1 47.12,16.05 50.04,13.13 86.74,13.13 90.68,17.07 90.68,17.85 90.74,17.9 ; v1(92.33,46.03) 92.2,46.15 v1(75.82,46.15)
$1N2040: length 362.5
  Top Layer w0.254: 41.82,72.38 40.66,72.38 ; 40.66,72.38 40.44,72.38 40.4,72.42 ; 40.66,72.38 40.67,72.39 ; 40.66,72.38 40.4,72.12 ; 90.04,72.3 90.02,72.33 ; 90.02,72.33 90.89,72.33 90.97,72.4 ; 90.02,72.33 89.84,72.51 ; 90.02,72.33 89.79,72.33 ; 66.4,72.42 65.48,72.42 ; 65.48,72.42 65.31,72.42 ; 65.48,72.42 65.49,72.44 ; 65.48,72.42 65.27,72.21 ; 89.79,72.33 89.79,48.95 90.04,48.69 90.92,48.69 Byte11.11 90.98,47.21 89.79,46.03 v1(89.79,44.88) 89.79,39.17 89.92,39.04 89.92,24.5 88.2,22.78 88.2,17.9 ; 89.79,72.33 89.79,86.16 89.66,86.28 89.66,95.17 89.88,95.39 Byte3.11 ; 65.48,72.45 65.29,72.64 65.27,72.64 ; 16.13,72.12 16.12,72.11 ; 16.13,72.12 16.36,72.35 16.36,72.39 16.09,72.39 ; 16.13,72.12 16.13,72.36 16.09,72.39 ; 16.12,72.11 16.13,72.1 16.13,48.95 16.38,48.69 17.33,48.69 Byte8.11 20.61,45.52 v1(41.83,45.52) v1(66.4,45.52) 75.18,45.52 v1(75.82,44.88) ; 16.12,72.11 16.12,72.1 ; Byte1.11 40.73,95.39 40.39,95.05 40.39,66.6 40.64,66.35 40.64,48.95 40.89,48.69 41.78,48.69 Byte9.11 ; 16.09,72.39 16.09,95.17 16.31,95.39 Byte0.11 ; Byte2.11 65.28,95.39 64.98,95.09 64.98,73.97 65.26,73.69 65.26,48.95 65.52,48.68 66.34,48.68 Byte10.11 ; 17.38,72.4 16.38,72.4 16.37,72.39 16.11,72.65 ; 90.08,72.31 89.86,72.09 89.81,72.09 ; 40.75,72.39 40.43,72.71 40.39,72.71
  Bottom Layer w0.254: R6.1 50.29,21.1 50.29,15.93 52.53,13.69 83.62,13.69 88.2,18.27 88.2,17.9 ; v1(75.82,44.88) v1(89.79,44.88) ; Byte10.11 v1(66.4,45.52) ; Byte9.11 v1(41.83,45.52)
$1N2047: length 356.4
  Top Layer w0.254: Byte3.12 88.27,95.43 87.38,95.43 87.12,95.17 87.12,72.39 ; 38.08,72.4 38.09,72.41 38.1,72.41 ; 38.08,72.4 37.87,72.4 37.85,72.42 ; 38.08,72.4 37.85,72.18 ; 38.08,72.4 38.11,72.4 ; 62.72,72.21 62.72,73.69 62.44,73.97 62.44,95.09 62.74,95.39 Byte2.12 ; 62.72,72.21 62.72,48.95 62.98,48.68 63.24,48.68 63.3,48.75 Byte10.12 ; 62.72,72.21 62.79,72.29 arc(62.83,72.34) 62.84,72.4 ; 62.72,72.21 62.71,72.21 ; 87.12,72.39 87.38,72.39 87.16,72.17 ; 87.12,72.39 87.12,49.07 87.5,48.69 88.38,48.69 88.39,48.7 ; 39.28,72.4 38.11,72.4 ; 38.11,72.4 38.1,72.41 ; Byte0.12 13.77,95.39 13.55,95.17 13.55,72.39 ; 37.85,72.42 37.85,95.05 38.19,95.39 Byte1.12 ; 37.85,72.42 37.85,62.79 37.97,62.66 37.97,48.95 38.23,48.69 39.24,48.69 Byte9.12 ; 88.39,48.7 88.39,47.17 87.25,46.03 87.25,24.31 85.66,22.72 85.66,17.9 ; 88.39,48.7 Byte11.12 ; Byte8.12 14.79,48.69 13.81,48.69 13.55,48.95 13.55,72.39 ; 13.55,72.39 13.82,72.39 13.82,72.35 13.56,72.09 ; 87.43,72.39 88.42,72.39 88.43,72.4 ; 38.11,72.41 38.1,72.41 ; 38.1,72.41 37.9,72.61 37.85,72.61 ; v1(26.67,74.23) v1(28.7,74.23) ; 62.72,72.63 62.76,72.58 arc(62.8,72.52) 62.82,72.45 ; v1(72.52,74.22) v1(74.29,74.22) ; 62.75,72.42 62.75,72.42 63.86,72.42 ; 13.57,72.65 13.83,72.39 13.84,72.4 14.84,72.4 ; v1(51.44,74.22) v1(53.47,74.22)
  Bottom Layer w0.254: 39.03,74.23 39.31,74.23 ; 39.03,74.23 v1(28.7,74.23) ; 39.03,74.23 39.02,74.24 ; 39.03,74.23 39.28,73.98 ; 39.31,74.23 51.42,74.23 v1(51.44,74.22) ; 39.31,74.23 39.28,74.2 39.28,73.98 ; 39.28,73.98 39.28,72.4 ; 39.28,73.98 39.3,73.96 ; 64.09,74.19 63.92,74.02 63.86,74.02 ; v1(26.67,74.23) 15.23,74.23 14.84,73.84 14.84,72.4 ; 63.86,72.4 63.88,72.43 63.88,73.97 63.63,74.22 ; R5.1 53.47,21.08 53.47,16.31 55.5,14.27 82.54,14.27 85.66,17.38 85.66,17.9 ; v1(74.29,74.22) 88.01,74.22 88.39,73.84 88.39,72.44 88.43,72.4 ; 39.56,74.22 39.35,74 39.29,74 ; v1(53.47,74.22) 63.63,74.22 ; 63.63,74.22 v1(72.52,74.22)
$1N2054: length 353.1
  Top Layer w0.254: Byte0.13 11.23,95.39 11.01,95.17 11.01,72.39 ; Byte8.13 12.25,48.69 11.27,48.69 11.01,48.95 11.01,72.39 ; 60.41,72.43 60.4,72.42 ; 60.4,72.42 60.2,72.62 ; 60.4,72.42 60.38,72.4 ; 60.4,72.42 60.42,72.41 ; 11.29,72.39 11.03,72.65 ; 11.29,72.39 11.28,72.39 ; 11.29,72.39 11.29,72.39 ; 11.29,72.39 12.29,72.39 12.3,72.4 ; Byte2.13 61.16,95.43 60.2,95.43 59.88,95.11 59.88,73.97 60.17,73.68 60.17,48.95 60.44,48.68 60.69,48.68 60.76,48.75 Byte10.13 ; 11.01,72.39 11.28,72.39 ; 35.3,72.67 35.28,72.69 ; 35.3,72.67 35.54,72.43 ; 35.3,72.67 35.3,72.18 ; 35.3,72.67 35.3,95.1 35.58,95.39 Byte1.13 ; v1(72.52,70.16) v1(74.42,70.16) ; 60.38,72.4 60.18,72.2 ; 60.38,72.4 60.22,72.4 60.21,72.42 ; 60.38,72.4 61.31,72.4 ; 11.28,72.39 11.28,72.39 ; 11.28,72.39 11.28,72.35 11.02,72.09 ; 84.53,72.41 84.53,95.21 84.71,95.39 Byte3.13 ; 84.53,72.41 84.54,72.4 84.77,72.4 ; 84.53,72.41 84.53,49 84.84,48.69 85.84,48.69 Byte11.13 85.9,47.21 84.67,45.99 84.67,24.34 83.12,22.78 83.12,17.9 ; 35.3,72.18 35.54,72.43 ; 35.3,72.18 35.3,49.02 35.57,48.75 Byte9.13 ; 35.54,72.43 36.72,72.43 36.74,72.4 ; 84.8,72.41 84.55,72.66 84.54,72.66 ; 84.77,72.4 84.78,72.4 ; 84.77,72.4 84.54,72.16 ; 84.77,72.4 85.89,72.4 ; v1(51.44,70.16) v1(53.59,70.16)
  Bottom Layer w0.254: 61.33,70.53 61.62,70.23 61.62,70.16 ; 61.33,70.53 61.32,70.54 ; 61.33,70.53 61.34,70.54 61.34,72.38 61.32,72.4 ; 61.33,70.53 61.31,70.51 ; 61.34,70.16 v1(72.52,70.16) ; 61.34,70.16 61.31,70.19 61.31,70.51 ; 61.34,70.16 60.96,70.16 ; 61.34,70.16 61.35,70.14 ; R4.1 56.71,17.12 59,14.84 80.95,14.84 83.06,16.94 83.06,17.85 83.12,17.9 ; v1(53.59,70.16) 60.96,70.16 ; 60.96,70.16 61.31,70.51 ; 36.7,70.48 36.7,70.2 36.69,70.2 ; 61.31,70.51 61.31,70.51 ; 36.32,70.16 12.7,70.16 12.3,70.56 12.3,72.4 ; 36.32,70.16 36.7,70.54 36.7,72.36 36.74,72.4 ; 36.32,70.16 v1(51.44,70.16) ; 36.71,70.5 36.99,70.23 36.99,70.18 ; 85.89,72.4 85.89,70.57 85.47,70.16 v1(74.42,70.16)
$1N2067: length 345.2
  Top Layer w0.254: 32.76,72.68 33.01,72.43 34.18,72.43 34.2,72.4 ; 32.76,72.68 32.74,72.7 ; 32.76,72.68 32.76,49.02 33.03,48.75 Byte9.14 ; 32.76,72.68 32.76,95.1 33.04,95.39 Byte1.14 ; 8.68,72.44 8.67,72.42 ; 8.67,72.42 8.67,72.42 ; 8.67,72.42 8.39,72.7 ; 8.67,72.42 8.65,72.4 ; Byte3.14 82.13,95.39 81.91,95.17 81.91,74.35 82.17,74.09 82.17,48.95 82.42,48.69 83.3,48.69 83.31,48.7 ; 82.41,72.41 82.18,72.64 ; 57.76,72.4 57.76,72.38 57.53,72.14 ; 57.76,72.4 57.76,72.41 ; 57.76,72.4 57.56,72.4 57.55,72.4 ; 57.76,72.4 58.77,72.4 ; 57.76,72.41 57.53,72.64 ; 57.76,72.41 57.76,72.42 ; 57.76,72.41 57.77,72.4 ; 57.53,72.64 57.53,73.71 57.28,73.97 57.28,95.05 57.62,95.39 Byte2.14 ; 57.53,72.64 57.53,48.95 57.78,48.69 58.73,48.69 Byte10.14 ; 8.38,72.41 8.38,48.95 8.64,48.69 9.71,48.69 Byte8.14 ; 8.38,72.41 8.39,72.4 8.65,72.4 ; 8.38,72.41 8.38,95.17 8.6,95.39 Byte0.14 ; 83.31,48.7 83.31,47.17 82.07,45.93 82.07,24.28 80.58,22.78 80.58,17.9 ; 83.31,48.7 Byte11.14 ; 83.35,72.4 82.19,72.4 82.19,72.4 ; 8.65,72.4 8.4,72.16 ; 8.65,72.4 9.76,72.4 ; 82.42,72.4 82.18,72.16 ; 32.78,72.11 33.09,72.41
  Bottom Layer w0.254: Byte2.14 58.67,95.37 58.67,93.65 58.66,93.64 ; 58.41,93.39 58.91,93.39 ; 58.41,93.39 58.66,93.64 ; 58.41,93.39 33.72,93.39 ; 58.91,93.39 58.66,93.64 ; 58.91,93.39 58.91,93.38 ; 58.91,93.39 82.92,93.39 83.31,93.78 83.31,95.31 Byte3.14 ; 58.66,93.64 58.66,93.64 ; 34.03,93.68 34.31,93.4 ; Byte1.14 34.04,95.34 34.04,93.7 33.72,93.39 ; Byte0.14 9.64,93.78 10.03,93.39 33.72,93.39 ; R3.1 59.94,21.1 59.94,17.2 61.8,15.34 78.54,15.34 80.58,17.38 80.58,17.9
$1N2076: length 341.2
  Top Layer w0.254: 80.81,72.4 80.79,72.43 79.8,72.43 ; Byte3.15 79.65,95.39 79.36,95.1 79.36,74.03 79.61,73.78 79.61,72.44 79.63,72.43 79.8,72.43 ; 6.1,72.43 5.8,72.73 ; 6.1,72.43 5.77,72.43 ; 6.1,72.43 7.19,72.43 7.22,72.4 ; 30.22,72.68 30.22,95.1 30.5,95.39 Byte1.15 ; 30.22,72.68 30.2,72.69 ; 30.22,72.68 30.25,72.68 30.51,72.43 31.64,72.43 31.66,72.4 ; 30.22,72.68 30.22,72.12 ; Byte9.15 30.49,48.75 30.22,49.02 30.22,72.12 ; 56.24,72.4 56.21,72.43 55.04,72.43 54.79,72.68 ; 5.77,95.1 5.76,95.1 ; 5.77,95.1 6.06,95.39 Byte0.15 ; 5.77,95.1 5.77,72.43 ; 79.8,72.41 79.8,72.36 79.61,72.18 ; 79.8,72.43 79.62,72.6 ; 79.8,72.43 79.8,72.42 ; 5.77,72.43 5.77,49.02 6.04,48.75 Byte8.15 ; 30.21,72.11 30.22,72.12 ; 30.22,72.12 30.52,72.42 ; 6.1,72.41 6.1,72.4 5.79,72.1 ; 54.79,72.68 54.79,95.1 55.08,95.39 Byte2.15 ; 54.79,72.68 54.79,49.02 55.06,48.75 Byte10.15 ; 54.79,72.68 54.78,72.69 ; 78.04,17.9 78.04,22.78 79.59,24.34 79.59,45.99 80.82,47.21 Byte11.15 79.86,48.75 79.61,49 79.61,72.41 79.57,72.37 ; 54.81,72.11 55.12,72.41
  Bottom Layer w0.254: 55.89,98.08 56.13,97.84 56.13,95.41 Byte2.15 ; 55.89,98.08 31.26,98.08 ; 55.89,98.08 80.28,98.08 80.65,97.71 80.65,95.43 Byte3.15 ; 56.4,98.07 56.19,97.87 56.13,97.87 ; 31.49,97.84 31.5,97.84 31.5,95.44 Byte1.15 ; 31.49,97.84 31.49,97.84 ; 31.49,97.84 31.73,98.08 ; 31.49,97.84 31.26,98.08 ; 78.04,17.9 78.04,17.64 76.23,15.83 65.37,15.83 63.1,18.1 R2.1 ; 31.26,98.08 7.35,98.08 7.1,97.83 Byte0.15
$1N2088: length 363.4
  Top Layer w0.254: 50.89,72.43 50.89,72.41 ; 50.89,72.43 50.85,72.43 50.85,72.51 arc(50.62,72.85) 50.54,73.26 ; 50.89,72.43 50.89,72.43 50.9,72.42 arc(50.9,72.42) 50.9,72.41 ; 50.89,72.41 50.56,72.41 50.55,72.42 ; 50.89,72.41 50.9,72.41 ; 50.89,72.41 50.89,72.4 ; 53.69,72.41 50.9,72.41 ; 50.9,72.41 arc(50.89,72.41) 50.89,72.4 ; 1.87,72.4 1.52,72.4 ; 1.87,72.4 4.69,72.4 ; 1.87,72.4 arc(1.88,72.41) 1.88,72.42 1.87,72.43 1.83,72.43 1.83,72.51 arc(1.6,72.86) 1.52,73.26 ; 1.87,72.4 arc(1.61,72.01) 1.52,71.55 ; 1.52,72.4 1.52,94.92 1.99,95.39 Byte0.16 4.56,98.33 5.08,98.86 28.83,98.86 ; 1.52,72.4 1.52,72.4 1.51,72.41 ; 1.52,72.4 1.52,71.55 ; 26.26,72.4 26.01,72.4 26,72.41 ; 29.08,98.61 29.32,98.86 ; 29.08,98.61 28.83,98.86 ; 29.08,98.61 29.07,98.61 ; 29.08,98.61 29.08,98.6 29.08,95.47 Byte1.16 26.44,95.39 25.97,94.92 25.97,71.55 ; 53.79,98.85 53.79,98.81 53.6,98.62 ; Byte10.16 53.63,48.82 51.05,48.82 50.54,49.33 50.54,71.55 ; 75.12,71.55 75.12,49.33 75.62,48.82 78.2,48.82 Byte11.16 77.05,47.52 77.05,24.4 75.5,22.84 75.5,17.9 ; 75.12,71.55 75.12,73.26 ; 75.12,71.55 arc(75.2,72) 75.45,72.39 ; 78.26,72.39 75.45,72.39 ; 75.45,72.39 75.12,72.39 ; 75.45,72.39 arc(75.46,72.4) 75.46,72.4 arc(75.47,72.41) 75.48,72.42 75.47,72.43 75.42,72.43 75.42,72.51 arc(75.2,72.86) 75.12,73.26 ; 50.54,71.55 50.54,94.92 51.01,95.39 Byte2.16 53.59,95.41 53.59,98.6 53.34,98.86 ; 50.54,71.55 arc(50.63,72.01) 50.89,72.4 ; Byte8.16 4.61,48.82 2.03,48.82 1.52,49.33 1.52,71.55 ; 25.97,71.55 25.97,49.33 26.48,48.82 29.06,48.82 Byte9.16 ; 25.97,71.55 arc(26.06,72.01) 26.31,72.4 ; 53.34,98.86 28.83,98.86 ; 53.34,98.86 77.72,98.86 78.1,98.48 78.1,95.43 Byte3.16 75.58,95.39 75.12,94.92 75.12,73.26 ; 29.13,72.4 26.31,72.4 ; 26.31,72.4 arc(26.32,72.41) 26.33,72.42 26.32,72.43 26.28,72.43 26.28,72.51 arc(26.05,72.86) 25.97,73.26
  Bottom Layer w0.254: R1.1 66.34,21.18 66.34,18.09 68.12,16.31 75.06,16.31 75.5,16.75 75.5,17.9
$1N6851: length 3.8
  Top Layer w0.254: Byte8.1 4.7,40.88 D1.1
$1N6855: length 3.8
  Top Layer w0.254: Byte8.2 7.24,40.88 D2.1
$1N6860: length 3.8
  Top Layer w0.254: Byte8.3 9.78,40.88 D3.1
$1N6865: length 3.8
  Top Layer w0.254: Byte8.4 12.32,40.88 D4.1
$1N6870: length 3.8
  Top Layer w0.254: Byte8.5 14.86,40.88 D5.1
$1N6875: length 3.8
  Top Layer w0.254: Byte8.6 17.38,37.09 D6.1
$1N6883: length 3.8
  Top Layer w0.254: D7.1 19.94,40.88 Byte8.7
$1N6888: length 3.8
  Top Layer w0.254: D8.1 22.48,40.88 Byte8.8
$1N6957: length 3.9
  Top Layer w0.254: Byte9.8 46.99,40.82 D16.1
$1N6961: length 3.9
  Top Layer w0.254: D15.1 44.45,40.82 Byte9.7
$1N6966: length 3.9
  Top Layer w0.254: D14.1 41.91,40.82 Byte9.6
$1N6971: length 3.9
  Top Layer w0.254: Byte9.5 39.37,40.82 D13.1
$1N6976: length 3.9
  Top Layer w0.254: Byte9.4 36.83,40.82 D12.1
$1N6981: length 3.9
  Top Layer w0.254: D11.1 34.21,37.15 Byte9.3
$1N6986: length 3.9
  Top Layer w0.254: Byte9.2 31.75,40.82 D10.1
$1N6991: length 3.8
  Top Layer w0.254: Byte9.1 29.08,40.85 D9.1
$1N6994: length 3.9
  Top Layer w0.254: D24.1 71.48,37.22 Byte10.8
$1N6996: length 3.9
  Top Layer w0.254: D23.1 69.05,40.79 Byte10.7
$1N6998: length 3.9
  Top Layer w0.254: Byte10.6 66.48,40.83 D22.1
$1N7000: length 3.8
  Top Layer w0.254: Byte10.5 63.9,40.86 D21.1
$1N7002: length 3.8
  Top Layer w0.254: D20.1 Byte10.4
$1N7004: length 3.8
  Top Layer w0.254: Byte10.3 58.75,40.86 D19.1
$1N7006: length 3.9
  Top Layer w0.254: Byte10.2 56.24,37.14 D18.1
$1N7008: length 3.9
  Top Layer w0.254: Byte10.1 53.7,37.18 D17.1
$1N7010: length 4
  Top Layer w0.254: Byte11.8 96.06,37.54 D32.1
$1N7012: length 4
  Top Layer w0.254: D31.1 93.52,37.46 Byte11.7
$1N7014: length 4
  Top Layer w0.254: D30.1 91.29,40.58 Byte11.6
$1N7016: length 3.9
  Top Layer w0.254: D29.1 88.68,40.65 Byte11.5
$1N7018: length 3.9
  Top Layer w0.254: Byte11.4 85.9,37.24 D28.1
$1N7020: length 3.9
  Top Layer w0.254: Byte11.3 83.36,37.17 D27.1
$1N7022: length 3.8
  Top Layer w0.254: Byte11.2 80.84,40.87 D26.1
$1N7024: length 3.8
  Top Layer w0.254: Byte11.1 78.28,37.12 D25.1
$1N9458: length 3.7
  Top Layer w0.254: D122.1 80.81,60.84 Byte7.2
$1N9460: length 3.7
  Top Layer w0.254: D123.1 83.35,64.55
$1N9462: length 3.7
  Top Layer w0.254: Byte7.4 85.91,64.54 D124.1
$1N9464: length 3.7
  Top Layer w0.254: Byte7.5 88.43,60.86 D125.1
$1N9466: length 3.8
  Top Layer w0.254: D126.1 90.97,60.87 Byte7.6
$1N9468: length 3.7
  Top Layer w0.254: Byte7.1 78.27,60.86 D121.1
$1N9470: length 3.8
  Top Layer w0.254: Byte7.8 96.05,60.91 D128.1
$1N9472: length 3.8
  Top Layer w0.254: D127.1 93.51,60.89 Byte7.7
$1N9474: length 3.7
  Top Layer w0.254: Byte6.3 58.78,60.86 D115.1
$1N9476: length 3.7
  Top Layer w0.254: D114.1 56.24,60.85 Byte6.2
$1N9478: length 3.9
  Top Layer w0.254: D120.1 71.88,64.15 Byte6.8
$1N9480: length 3.9
  Top Layer w0.254: D119.1 69.27,64.22 Byte6.7
$1N9482: length 3.8
  Top Layer w0.254: Byte6.6 66.66,64.29 D118.1
$1N9484: length 3.8
  Top Layer w0.254: D117.1 64.04,64.36 Byte6.5
$1N9486: length 3.8
  Top Layer w0.254: D116.1 61.32,60.94 Byte6.4
$1N9488: length 3.8
  Top Layer w0.254: D113.1 53.7,60.92 Byte6.1
$1N9490: length 3.8
  Top Layer w0.254: Byte5.6 41.98,64.39 D110.1
$1N9492: length 3.8
  Top Layer w0.254: Byte5.5 39.35,64.48 D109.1
$1N9494: length 3.7
  Top Layer w0.254: Byte5.4 36.74,60.84 D108.1
$1N9496: length 3.9
  Top Layer w0.254: D112.1 46.9,61.16 Byte5.8
$1N9498: length 3.8
  Top Layer w0.254: D111.1 44.61,64.3 Byte5.7
$1N9500: length 3.8
  Top Layer w0.254: Byte5.3 34.2,60.93 D107.1
$1N9502: length 3.8
  Top Layer w0.254: D106.1 31.46,64.35 Byte5.2
$1N9504: length 3.9
  Top Layer w0.254: D105.1 28.83,64.26 Byte5.1
$1N9506: length 3.8
  Top Layer w0.254: D98.1 7.22,60.87 Byte4.2
$1N9508: length 3.7
  Top Layer w0.254: Byte4.3 9.76,60.82 D99.1
$1N9510: length 3.8
  Top Layer w0.254: D102.1 17.54,64.39 Byte4.6
$1N9512: length 3.8
  Top Layer w0.254: D104.1 22.46,61.1 Byte4.8
$1N9514: length 3.8
  Top Layer w0.254: D103.1 19.92,61.04 Byte4.7
$1N9516: length 3.8
  Top Layer w0.254: Byte4.4 12.3,60.88 D100.1
$1N9518: length 3.8
  Top Layer w0.254: Byte4.5 14.95,64.44 D101.1
$1N9520: length 3.8
  Top Layer w0.254: D97.1 4.68,60.93 Byte4.1
$1N9528: length 3.6
  Top Layer w0.254: D93.1 88.31,84.31 Byte3.5
$1N9530: length 3.5
  Top Layer w0.254: D92.1 85.94,87.37 Byte3.4
$1N9532: length 3.5
  Top Layer w0.254: Byte3.3 83.33,87.44 D91.1
$1N9534: length 3.5
  Top Layer w0.254: D90.1 80.72,87.51 Byte3.2
$1N9536: length 3.5
  Top Layer w0.254: Byte3.1 78.1,87.5 D89.1
$1N9538: length 3.5
  Top Layer w0.254: D88.1 71.36,84.17 Byte2.8
$1N9542: length 3.5
  Top Layer w0.254: Byte2.6 66.28,84.17 D86.1
$1N9544: length 3.5
  Top Layer w0.254: Byte2.5 63.74,84.17 D85.1
$1N9546: length 3.5
  Top Layer w0.254: Byte2.4 61.2,84.17 D84.1
$1N9548: length 3.5
  Top Layer w0.254: Byte2.3 58.66,84.17 D83.1
$1N9554: length 3.5
  Top Layer w0.254: D79.1 44.2,87.49 Byte1.7
$1N9556: length 3.5
  Top Layer w0.254: Byte1.8 46.78,84.11 D80.1
$1N9558: length 3.5
  Top Layer w0.254: D78.1 41.7,84.11 Byte1.6
$1N9560: length 3.5
  Top Layer w0.254: Byte1.5 39.12,87.49 D77.1
$1N9562: length 3.5
  Top Layer w0.254: D76.1 36.58,87.49 Byte1.4
$1N9564: length 3.5
  Top Layer w0.254: D75.1 34.08,84.11 Byte1.3
$1N9566: length 3.5
  Top Layer w0.254: D73.1 29,84.11 Byte1.1
$1N9568: length 3.5
  Top Layer w0.254: D74.1 31.5,87.49 Byte1.2
$1N9570: length 3.5
  Top Layer w0.254: Byte0.7 19.81,87.52 D71.1
$1N9572: length 3.5
  Top Layer w0.254: Byte0.8 22.34,84.08 D72.1
$1N9574: length 3.5
  Top Layer w0.254: D69.1 14.73,87.52 Byte0.5
$1N9576: length 3.5
  Top Layer w0.254: Byte0.6 17.27,87.52 D70.1
$1N9578: length 3.5
  Top Layer w0.254: Byte0.4 12.18,84.08 D68.1
$1N9580: length 3.5
  Top Layer w0.254: D66.1 7.11,87.52 Byte0.2
$1N9582: length 3.5
  Top Layer w0.254: D67.1 9.65,87.52 Byte0.3
$1N9584: length 3.5
  Top Layer w0.254: Byte0.1 4.57,87.52 D65.1
$1N9668: length 3.5
  Top Layer w0.254: D82.1 56.01,87.43 Byte2.2
$1N9672: length 3.5
  Top Layer w0.254: D81.1 53.58,84.17 Byte2.1
$1N9677: length 3.5
  Top Layer w0.254: D87.1 68.71,87.43 Byte2.7
$1N9761: length 3.6
  Top Layer w0.254: D94.1 91.17,87.22 Byte3.6
$1N9765: length 3.6
  Top Layer w0.254: D95.1 93.39,84.45 Byte3.7
$1N9770: length 3.7
  Top Layer w0.254: Byte3.8 96.39,87.08 D96.1
$1N30826: length 3
  Top Layer w0.254: PWR.1 39.56,11.29 39.33,11.06

## Copper pours and planes (outline as drawn; the poured copper is in the pictures)
GND on Top Layer: -4.37,103.15 104.04,103.15 104.04,-5.41 -4.37,-5.41
GND on Bottom Layer: -9.94,105.35 108,105.35 108,-9.37 -9.94,-9.37

Small or netless copper shapes (teardrops, artwork), in the pictures only: 505 on Top Layer, 276 on Bottom Layer

## Text on the board
Bottom Silkscreen Layer: TD4-CPU / ROM / 12 BYTES
Top Silkscreen Layer: GND | 74HC154 | +5V | 74HC540 | WISE100K | TD4-CPU / ROM / 12 BYTES
